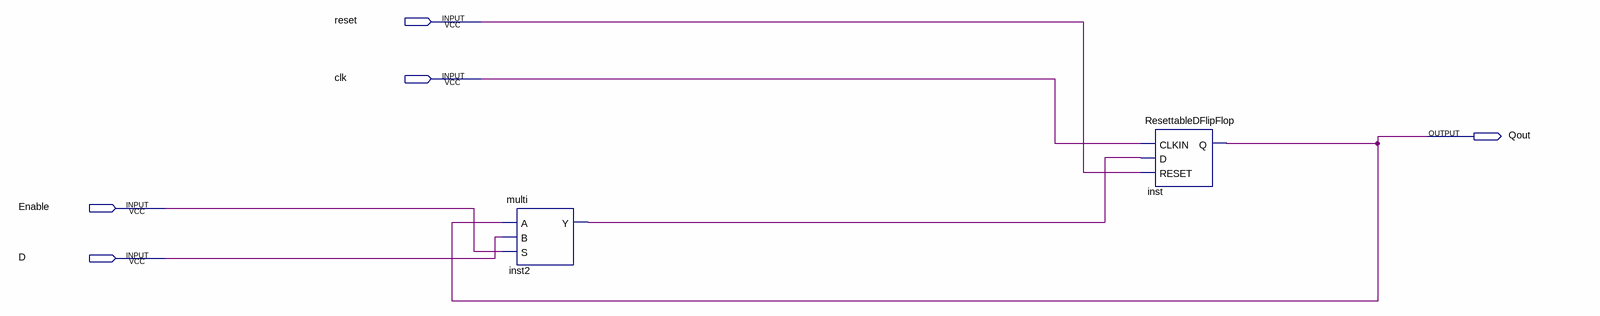
[diagram p0: schematic sheet]
// Quartus schematic singlebitwithenable.bdf as structural Verilog: 2 symbols, 5 pins
module singlebitwithenable (
  input  reset,
  input  clk,
  input  Enable,
  input  D,
  output Qout
);

  wire inst2_y;

  multi inst2 (.A(Qout), .B(D), .S(Enable), .Y(inst2_y));
  ResettableDFlipFlop inst (.CLKIN(clk), .D(inst2_y), .RESET(reset), .Q(Qout));
endmodule
